# EAGLE design ADC_LoadCell_Board (EAGLE 6.5.0)
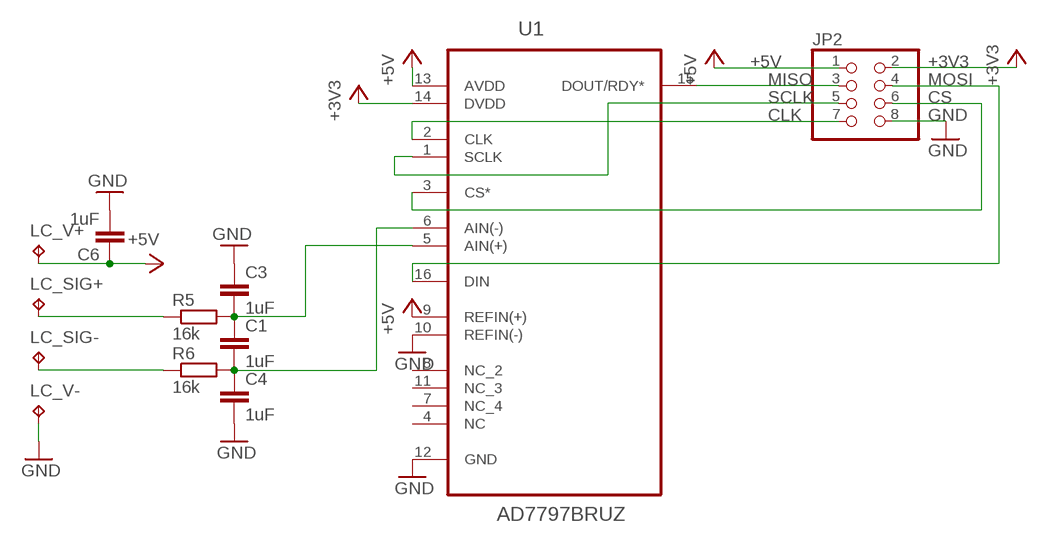
[diagram p0: schematic, sheet 1]

## Parts
C1  1uF  C-EUC0805  [C0805]
C3  1uF  C-EUC0805  [C0805]
C4  1uF  C-EUC0805  [C0805]
C6  1uF  C-EUC0805  [C0805]
JP2  PINHD-2X4  [2X04]
LC_SIG+  TPB1,27  [B1,27]
LC_SIG-  TPB1,27  [B1,27]
LC_V+  TPB1,27  [B1,27]
LC_V-  TPB1,27  [B1,27]
R5  16k  R-EU_R0805  [R0805]
R6  16k  R-EU_R0805  [R0805]
U1  AD7797BRUZ  [SOP65P640X120-16N]

## Nets
+3V3: JP2.2 U1.14(DVDD)
+5V: C6.1 JP2.1 LC_V+.TP U1.9(REFIN(+)) U1.13(AVDD)
CLK: JP2.7 U1.2(CLK)
CS: JP2.6 U1.3(CS*)
GND: C3.1 C4.2 C6.2 JP2.8 LC_V-.TP U1.10(REFIN(-)) U1.12(GND)
MISO: JP2.3 U1.15(DOUT/RDY*)
MOSI: JP2.4 U1.16(DIN)
N$6: LC_SIG+.TP R5.1
N$7: LC_SIG-.TP R6.1
N$8: C1.1 C3.2 R5.2 U1.5(AIN(+))
N$9: C1.2 C4.1 R6.2 U1.6(AIN(-))
SCLK: JP2.5 U1.1(SCLK)
Unconnected: U1.4(NC) U1.7(NC_4) U1.8(NC_2) U1.11(NC_3)

## Library data of the parts
C1 C3 C4 C6 = resistor:C-EU: CAPACITOR, European symbol
JP2 = pinhead:PINHD-2X4: PIN HEADER
LC_SIG+ LC_SIG- LC_V+ LC_V- = testpad:TP: Test pad
R5 R6 = rcl:R-EU_: RESISTOR, European symbol
U1 = ADI-Phase-2:AD7797BRUZ: 24-Bit Sigma-Delta Analog-to-Digital Converters for Bridge Sensors; MPN: AD7797BRUZ; OC_FARNELL: 1306151; OC_NEWARK: 28M4066; PACKAGE: TSSOP-16; SUPPLIER: Analog Devices

## Board
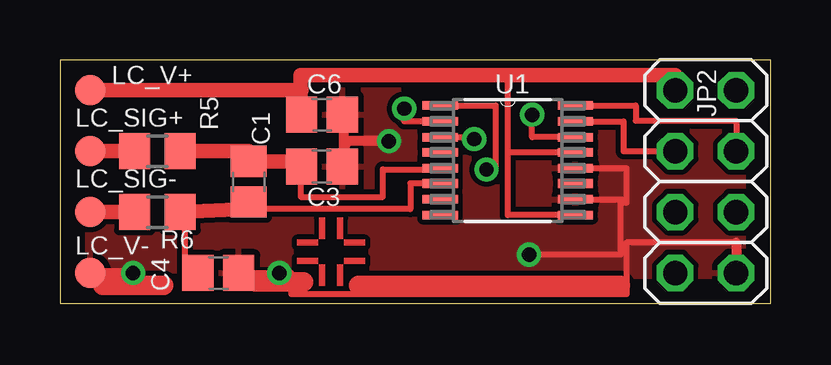
[diagram p1: board, top side]
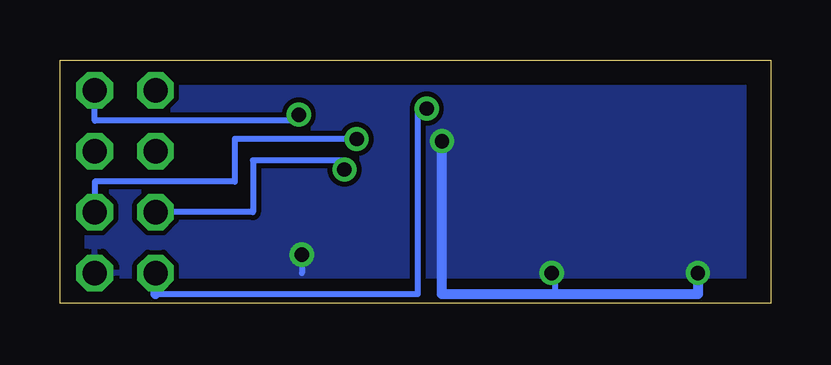
[diagram p2: board, bottom side, seen from below]

Size 29.64 x 10.15 mm. Coordinates in mm from the lower left corner, seen from the top.
Outline: 0,0 29.64,0 29.64,10.15 0,10.15 0,0
Copper layers (1*16): Top 0.035mm / dielectric 1.5mm / Bottom 0.035mm
Design rules "default": minimum track width 10mil, minimum drill 24mil, track to track 8mil, track to pad 8mil, pad to pad 8mil, via to via 8mil, smd to smd 8mil, copper to edge 40mil, drill to drill 8mil, minimum pad ring 10mil, minimum via ring 8mil, stop-mask expansion 4mil, vias tented up to drill 0mil, thermal gap 10mil

### Footprints (pad centres in the part's own frame; a part is rotated, then mirrored left to right if it is on the bottom)
C0805 = smd 1.3 x 1.5: 1 -0.85,0; 2 0.85,0
2X04 = drill 1.016 octagon: 1 -3.81,-1.27; 2 -3.81,1.27; 3 -1.27,-1.27; 4 -1.27,1.27; 5 1.27,-1.27; 6 1.27,1.27; 7 3.81,-1.27; 8 3.81,1.27
B1,27 = smd 1.27 x 1.27: TP 0,0
R0805 = smd 1.3 x 1.5: 1 -0.95,0; 2 0.95,0
SOP65P640X120-16N = smd 1.473 x 0.356: 1 -2.819,2.286; 2 -2.819,1.626; 3 -2.819,0.965; 4 -2.819,0.33; 5 -2.819,-0.33; 6 -2.819,-0.965; 7 -2.819,-1.626; 8 -2.819,-2.286; 9 2.819,-2.286; 10 2.819,-1.626; 11 2.819,-0.965; 12 2.819,-0.33; 13 2.819,0.33; 14 2.819,0.965; 15 2.819,1.626; 16 2.819,2.286

### Placement (x,y rotation side)
C1  7.87,5.08 270 top
C3  10.92,5.71 180 top
C4  6.6,1.27 0 top
C6  10.92,7.87 0 top
JP2  26.92,5.08 270 top
LC_SIG+  1.27,6.35 0 top
LC_SIG-  1.27,3.81 0 top
LC_V+  1.27,8.89 0 top
LC_V-  1.27,1.27 0 top
R5  4.06,6.35 0 top
R6  4.06,3.81 0 top
U1  18.67,5.97 0 top
U$2  [PASSER]  11.3,2.16 0 top

### Tracks (layer width: path | path; a pad name or v marks a point on that pad's centre or on a via)
+3V3  (via drill 0.6)
  Top 0.254: U1.14 19.68,6.93 v19.68,7.87
  Bottom 0.254: v19.68,7.87 19.68,7.62 28.19,7.62 JP2.2
+5V
  Top 0.254: U1.13 18.67,6.3 | 18.67,6.3 18.67,9.53 | U1.9 18.67,3.68 18.67,6.3
  Top 0.406: 10.07,8.89 C6.1 10.03,7.87
  Top 0.61: LC_V+.TP 10.07,8.89 | 10.03,7.87 10.03,9.53 18.67,9.53 25.65,9.53 JP2.1
CLK  (via drill 0.6)
  Top 0.254: U1.2 14.35,7.59 v14.35,8.13
  Bottom 0.254: v14.35,8.13 14.73,8.13 14.73,0.38 25.65,0.38
  Bottom 0.406: 25.65,0.38 JP2.7
CS  (via drill 0.6)
  Top 0.254: U1.3 17.27,6.93 v17.27,6.86
  Bottom 0.254: v17.27,6.86 22.35,6.86 22.35,5.08 28.19,5.08 JP2.6
GND  (via drill 0.6)
  Top 0.254: 28.19,2.54 23.62,2.54 23.62,0.38 9.65,0.38 9.65,1.27 v9.14,1.27 C4.2 | U1.12 23.62,5.64 23.62,4.34 | 23.62,4.34 23.62,4.32 | 23.62,4.32 21.49,4.32 U1.10 23.62,4.34 | 23.62,4.32 23.62,4.19 23.37,4.19 23.37,2.03 v19.56,2.03
  Top 0.406: LC_V-.TP v3.05,1.27 | v13.72,6.77 11.9,6.77 11.83,6.22 | 11.83,6.22 C3.1 | C6.2 11.83,7.87 11.83,6.22 | 28.19,2.54 JP2.8
  Bottom 0.254: v9.14,1.27 9.02,1.27 9.02,0.38 | v19.56,2.03 19.56,1.27
  Bottom 0.406: v3.05,1.27 3.05,0.38 9.02,0.38 13.72,0.38 v13.72,6.77
  pour Bottom: 0.13,10.03 0.13,0.13 29.59,0.13 29.59,10.03
  pour Top: 0.13,10.03 0.13,0.13 29.59,0.13 29.59,10.03
MISO
  Top 0.254: U1.15 23.5,7.59 23.5,6.35 JP2.3
MOSI
  Top 0.254: U1.16 24,8.26 24,7.62 28.19,7.62 JP2.4
N$1
  Top 0.813: 12.45,0.76 23.37,0.76
N$2
  Top 0.813: 4.32,0.76 1.78,0.76
N$3
  Top 0.813: 8.13,0.89 10.16,0.89
N$6
  Top 0.61: LC_SIG+.TP R5.1
N$7
  Top 0.61: LC_SIG-.TP R6.1
N$8
  Top 0.254: 7.87,6.35 C1.1 | 10.16,5.93 C3.2 10.16,5.64 10.03,5.64 10.03,4.45 13.46,4.45 13.46,5.59 15.85,5.59 U1.5
  Top 0.61: R5.2 7.87,6.35 | C1.1 10.16,5.93
N$9
  Top 0.254: C1.2 7.87,3.94 14.61,3.94 14.61,5 U1.6 | R6.2 5.21,3.81 5.21,1.27 C4.1
  Top 0.61: 7.87,3.94 R6.2
SCLK  (via drill 0.6)
  Top 0.254: U1.1 18.16,8.26 18.16,5.59 v17.78,5.59
  Bottom 0.254: v17.78,5.59 17.78,5.97 21.59,5.97 21.59,3.81 JP2.5